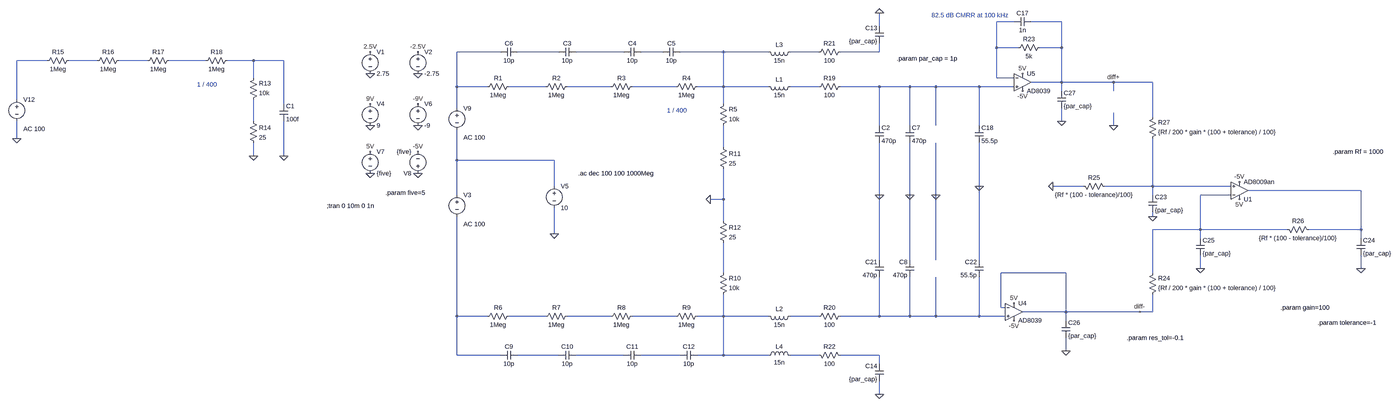
[diagram p0: schematic ac_analysis.asc, whole sheet]
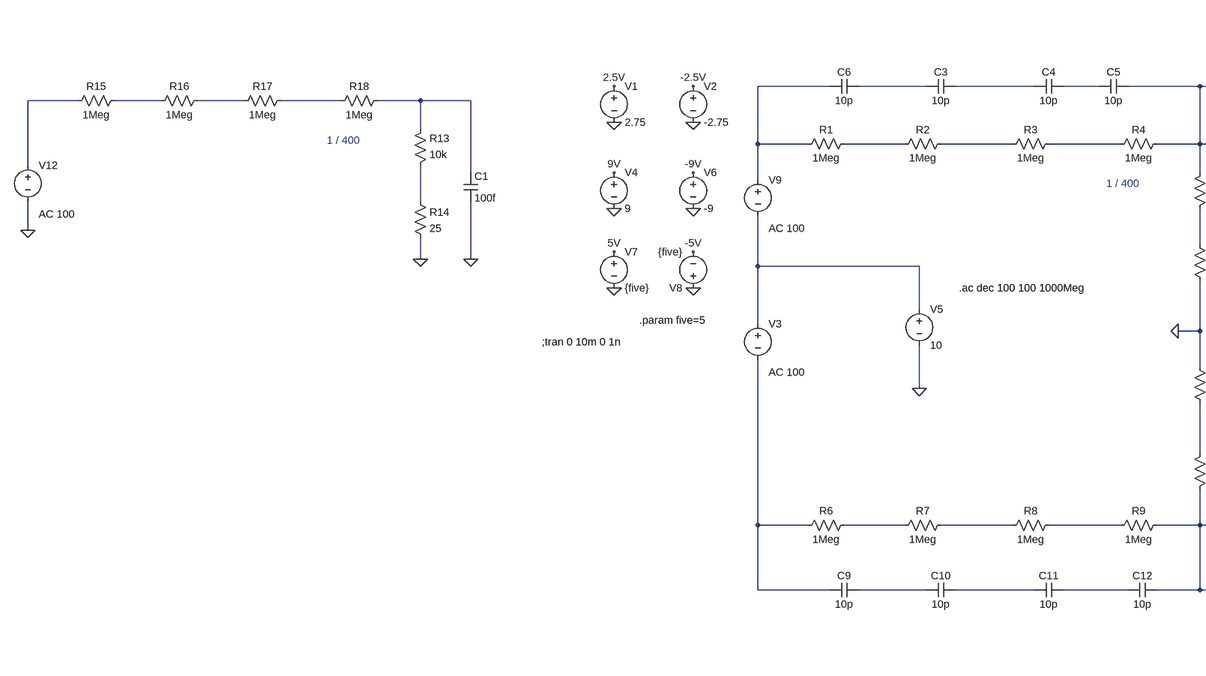
[diagram p1: schematic ac_analysis.asc, part, row 1 of 1, column 1 of 2]
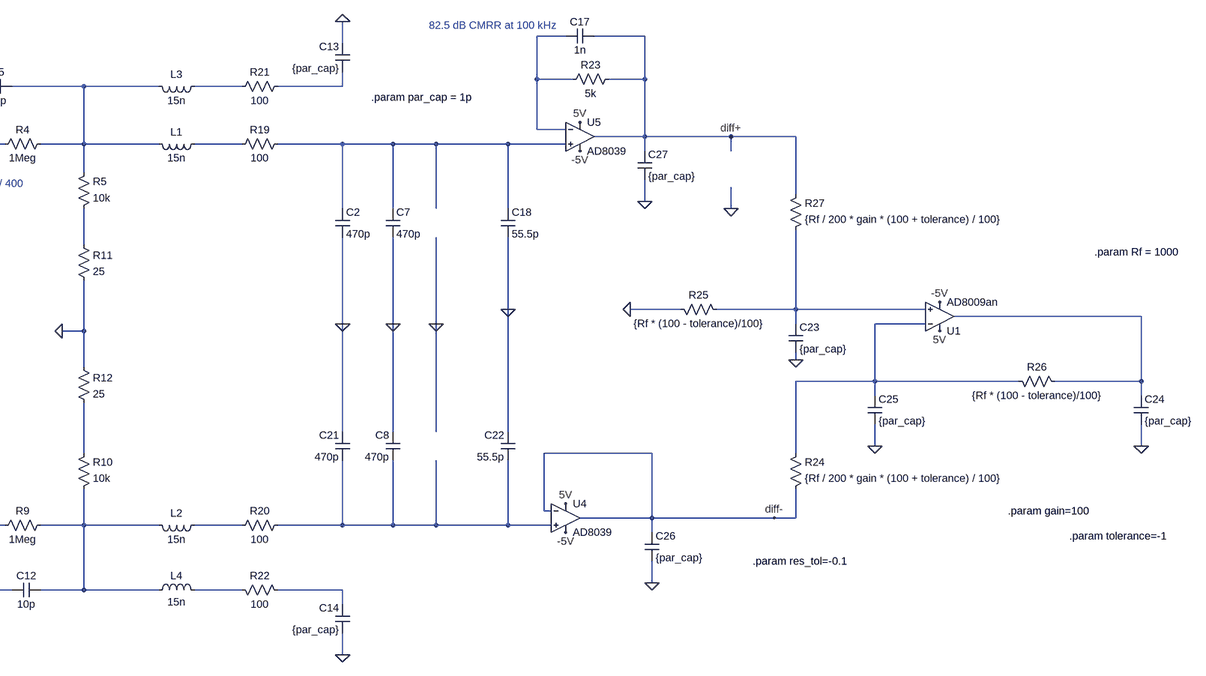
[diagram p2: schematic ac_analysis.asc, part, row 1 of 1, column 2 of 2]
ac_analysis.asc, the LTspice schematic file:
Version 4
SHEET 1 3908 1588
WIRE 2496 -368 2432 -368
WIRE 2672 -368 2560 -368
WIRE 2000 -352 2000 -400
WIRE 2432 -272 2432 -368
WIRE 2512 -272 2432 -272
WIRE 2672 -272 2672 -368
WIRE 2672 -272 2592 -272
WIRE 400 -256 240 -256
WIRE 640 -256 464 -256
WIRE 880 -256 704 -256
WIRE 1024 -256 944 -256
WIRE 1248 -256 1088 -256
WIRE 1456 -256 1248 -256
WIRE 1776 -256 1536 -256
WIRE 2000 -256 2000 -288
WIRE 2000 -256 1856 -256
WIRE -1520 -224 -1632 -224
WIRE -1280 -224 -1440 -224
WIRE -1040 -224 -1200 -224
WIRE -800 -224 -960 -224
WIRE -624 -224 -720 -224
WIRE -512 -224 -624 -224
WIRE -624 -160 -624 -224
WIRE 2432 -160 2432 -272
WIRE 2496 -160 2432 -160
WIRE 2672 -144 2672 -272
WIRE 2672 -144 2560 -144
WIRE 2864 -144 2672 -144
WIRE 3008 -144 2864 -144
WIRE 240 -128 240 -256
WIRE 352 -128 240 -128
WIRE 592 -128 432 -128
WIRE 832 -128 672 -128
WIRE 1072 -128 912 -128
WIRE 1248 -128 1248 -256
WIRE 1248 -128 1152 -128
WIRE 1456 -128 1248 -128
WIRE 1776 -128 1536 -128
WIRE 2000 -128 1856 -128
WIRE 2112 -128 2000 -128
WIRE 2208 -128 2112 -128
WIRE 2368 -128 2208 -128
WIRE 2496 -128 2368 -128
WIRE 2672 -112 2672 -144
WIRE 2864 -112 2864 -144
WIRE -1632 -80 -1632 -224
WIRE -512 -64 -512 -224
WIRE 1248 -64 1248 -128
WIRE 240 -48 240 -128
WIRE 3008 -16 3008 -144
WIRE -624 0 -624 -80
WIRE 2672 0 2672 -48
WIRE 2000 16 2000 -128
WIRE 2112 16 2112 -128
WIRE 2208 16 2208 -128
WIRE 2368 16 2368 -128
WIRE 2864 16 2864 -32
WIRE -1632 64 -1632 0
WIRE 1248 96 1248 16
WIRE -624 128 -624 80
WIRE -512 128 -512 0
WIRE 240 144 240 32
WIRE 624 144 240 144
WIRE 624 240 624 144
WIRE 2368 240 2368 80
WIRE 2752 240 2640 240
WIRE 3008 240 3008 64
WIRE 3008 240 2832 240
WIRE 3296 240 3008 240
WIRE 3776 256 3360 256
WIRE 240 272 240 144
WIRE 2000 272 2000 80
WIRE 2112 272 2112 80
WIRE 2208 272 2208 80
WIRE 3008 272 3008 240
WIRE 3296 272 3184 272
WIRE 1248 288 1248 176
WIRE 1248 288 1200 288
WIRE 3008 352 3008 336
WIRE 1248 368 1248 288
WIRE 3184 400 3184 272
WIRE 3184 400 3008 400
WIRE 3504 400 3184 400
WIRE 3776 400 3776 256
WIRE 3776 400 3584 400
WIRE 624 416 624 320
WIRE 3184 432 3184 400
WIRE 3776 432 3776 400
WIRE 2000 512 2000 272
WIRE 2112 512 2112 272
WIRE 2208 512 2208 272
WIRE 2368 512 2368 240
WIRE 3184 544 3184 496
WIRE 3776 544 3776 496
WIRE 1248 560 1248 448
WIRE 2688 560 2448 560
WIRE 3008 560 3008 400
WIRE 2448 688 2448 560
WIRE 2464 688 2448 688
WIRE 2688 704 2688 560
WIRE 2688 704 2528 704
WIRE 2960 704 2688 704
WIRE 3008 704 3008 640
WIRE 3008 704 2960 704
WIRE 240 720 240 352
WIRE 352 720 240 720
WIRE 592 720 432 720
WIRE 832 720 672 720
WIRE 1072 720 912 720
WIRE 1248 720 1248 640
WIRE 1248 720 1152 720
WIRE 1456 720 1248 720
WIRE 1776 720 1536 720
WIRE 2000 720 2000 576
WIRE 2000 720 1856 720
WIRE 2112 720 2112 576
WIRE 2112 720 2000 720
WIRE 2208 720 2208 576
WIRE 2208 720 2112 720
WIRE 2368 720 2368 576
WIRE 2368 720 2208 720
WIRE 2464 720 2368 720
WIRE 2688 736 2688 704
WIRE 2688 848 2688 800
WIRE 240 864 240 720
WIRE 400 864 240 864
WIRE 640 864 464 864
WIRE 880 864 704 864
WIRE 1088 864 944 864
WIRE 1248 864 1248 720
WIRE 1248 864 1152 864
WIRE 1456 864 1248 864
WIRE 1776 864 1536 864
WIRE 2000 864 1856 864
WIRE 2000 896 2000 864
WIRE 2000 1008 2000 960
FLAG -80 -176 0
FLAG -80 -256 2.5V
FLAG 96 -176 0
FLAG 96 -256 -2.5V
FLAG 1200 288 0
FLAG 2208 272 0
FLAG 624 416 0
FLAG 2112 272 0
FLAG -80 16 0
FLAG -80 -64 9V
FLAG 96 16 0
FLAG 96 -64 -9V
FLAG -80 192 0
FLAG -80 112 5V
FLAG 96 192 0
FLAG 96 112 -5V
FLAG 2000 272 0
FLAG -624 128 0
FLAG -1632 64 0
FLAG -512 128 0
FLAG 2000 -400 0
FLAG 2000 1008 0
FLAG 2864 16 0
FLAG 2368 240 0
FLAG 2528 -176 5V
FLAG 2528 -112 -5V
FLAG 2640 240 0
FLAG 2496 672 5V
FLAG 2496 736 -5V
FLAG 3328 288 5V
FLAG 3328 224 -5V
FLAG 2864 -144 diff+
FLAG 2960 704 diff-
FLAG 3008 352 0
FLAG 3184 544 0
FLAG 3776 544 0
FLAG 2688 848 0
FLAG 2672 0 0
SYMBOL voltage -80 -272 R0
SYMATTR InstName V1
SYMATTR Value 2.75
SYMBOL voltage 96 -272 R0
SYMATTR InstName V2
SYMATTR Value -2.75
SYMBOL voltage 240 256 R0
WINDOW 123 24 124 Left 2
WINDOW 39 0 0 Left 0
SYMATTR Value2 AC 100
SYMATTR InstName V3
SYMATTR Value ""
SYMBOL res 1232 656 M180
WINDOW 0 36 76 Left 2
WINDOW 3 36 40 Left 2
SYMATTR InstName R10
SYMATTR Value 10k
SYMBOL cap 464 -272 R90
WINDOW 0 0 32 VBottom 2
WINDOW 3 32 32 VTop 2
SYMATTR InstName C6
SYMATTR Value 10p
SYMBOL cap 704 -272 R90
WINDOW 0 0 32 VBottom 2
WINDOW 3 32 32 VTop 2
SYMATTR InstName C3
SYMATTR Value 10p
SYMBOL cap 944 -272 R90
WINDOW 0 0 32 VBottom 2
WINDOW 3 32 32 VTop 2
SYMATTR InstName C4
SYMATTR Value 10p
SYMBOL cap 1088 -272 R90
WINDOW 0 0 32 VBottom 2
WINDOW 3 32 32 VTop 2
SYMATTR InstName C5
SYMATTR Value 10p
SYMBOL cap 464 848 R90
WINDOW 0 0 32 VBottom 2
WINDOW 3 32 32 VTop 2
SYMATTR InstName C9
SYMATTR Value 10p
SYMBOL cap 704 848 R90
WINDOW 0 0 32 VBottom 2
WINDOW 3 32 32 VTop 2
SYMATTR InstName C10
SYMATTR Value 10p
SYMBOL cap 944 848 R90
WINDOW 0 0 32 VBottom 2
WINDOW 3 32 32 VTop 2
SYMATTR InstName C11
SYMATTR Value 10p
SYMBOL cap 1152 848 R90
WINDOW 0 0 32 VBottom 2
WINDOW 3 32 32 VTop 2
SYMATTR InstName C12
SYMATTR Value 10p
SYMBOL res 1232 32 M180
WINDOW 0 36 76 Left 2
WINDOW 3 36 40 Left 2
SYMATTR InstName R5
SYMATTR Value 10k
SYMBOL voltage 624 224 R0
WINDOW 123 0 0 Left 0
WINDOW 39 0 0 Left 0
SYMATTR InstName V5
SYMATTR Value 10
SYMBOL cap 2096 16 R0
SYMATTR InstName C7
SYMATTR Value 470p
SYMBOL cap 2128 576 R180
WINDOW 0 24 56 Left 2
WINDOW 3 24 8 Left 2
SYMATTR InstName C8
SYMATTR Value 470p
SYMBOL voltage -80 -80 R0
SYMATTR InstName V4
SYMATTR Value 9
SYMBOL voltage 96 -80 R0
SYMATTR InstName V6
SYMATTR Value -9
SYMBOL voltage -80 96 R0
SYMATTR InstName V7
SYMATTR Value {five}
SYMBOL voltage 96 208 R180
WINDOW 123 0 0 Left 0
WINDOW 39 0 0 Left 0
SYMATTR InstName V8
SYMATTR Value {five}
SYMBOL res 1232 80 R0
SYMATTR InstName R11
SYMATTR Value 25
SYMBOL res 1232 352 R0
SYMATTR InstName R12
SYMATTR Value 25
SYMBOL cap 1984 16 R0
SYMATTR InstName C2
SYMATTR Value 470p
SYMBOL cap 2016 576 R180
WINDOW 0 24 56 Left 2
WINDOW 3 24 8 Left 2
SYMATTR InstName C21
SYMATTR Value 470p
SYMBOL voltage 240 -64 R0
WINDOW 123 24 124 Left 2
WINDOW 39 0 0 Left 0
SYMATTR Value2 AC 100
SYMATTR InstName V9
SYMATTR Value ""
SYMBOL ind 1552 -144 R90
WINDOW 0 5 56 VBottom 2
WINDOW 3 32 56 VTop 2
SYMATTR InstName L1
SYMATTR Value 15n
SYMBOL res 448 -144 R90
WINDOW 0 0 56 VBottom 2
WINDOW 3 32 56 VTop 2
SYMATTR InstName R1
SYMATTR Value 1Meg
SYMBOL res 688 -144 R90
WINDOW 0 0 56 VBottom 2
WINDOW 3 32 56 VTop 2
SYMATTR InstName R2
SYMATTR Value 1Meg
SYMBOL res 928 -144 R90
WINDOW 0 0 56 VBottom 2
WINDOW 3 32 56 VTop 2
SYMATTR InstName R3
SYMATTR Value 1Meg
SYMBOL res 1168 -144 R90
WINDOW 0 0 56 VBottom 2
WINDOW 3 32 56 VTop 2
SYMATTR InstName R4
SYMATTR Value 1Meg
SYMBOL res 448 704 R90
WINDOW 0 0 56 VBottom 2
WINDOW 3 32 56 VTop 2
SYMATTR InstName R6
SYMATTR Value 1Meg
SYMBOL res 688 704 R90
WINDOW 0 0 56 VBottom 2
WINDOW 3 32 56 VTop 2
SYMATTR InstName R7
SYMATTR Value 1Meg
SYMBOL res 928 704 R90
WINDOW 0 0 56 VBottom 2
WINDOW 3 32 56 VTop 2
SYMATTR InstName R8
SYMATTR Value 1Meg
SYMBOL res 1168 704 R90
WINDOW 0 0 56 VBottom 2
WINDOW 3 32 56 VTop 2
SYMATTR InstName R9
SYMATTR Value 1Meg
SYMBOL res -640 -64 M180
WINDOW 0 36 76 Left 2
WINDOW 3 36 40 Left 2
SYMATTR InstName R13
SYMATTR Value 10k
SYMBOL res -640 -16 R0
SYMATTR InstName R14
SYMATTR Value 25
SYMBOL voltage -1632 -96 R0
WINDOW 123 24 124 Left 2
WINDOW 39 0 0 Left 0
SYMATTR Value2 AC 100
SYMATTR InstName V12
SYMATTR Value ""
SYMBOL res -1424 -240 R90
WINDOW 0 0 56 VBottom 2
WINDOW 3 32 56 VTop 2
SYMATTR InstName R15
SYMATTR Value 1Meg
SYMBOL res -1184 -240 R90
WINDOW 0 0 56 VBottom 2
WINDOW 3 32 56 VTop 2
SYMATTR InstName R16
SYMATTR Value 1Meg
SYMBOL res -944 -240 R90
WINDOW 0 0 56 VBottom 2
WINDOW 3 32 56 VTop 2
SYMATTR InstName R17
SYMATTR Value 1Meg
SYMBOL res -704 -240 R90
WINDOW 0 0 56 VBottom 2
WINDOW 3 32 56 VTop 2
SYMATTR InstName R18
SYMATTR Value 1Meg
SYMBOL cap -528 -64 R0
SYMATTR InstName C1
SYMATTR Value 100f
SYMBOL ind 1552 704 R90
WINDOW 0 5 56 VBottom 2
WINDOW 3 32 56 VTop 2
SYMATTR InstName L2
SYMATTR Value 15n
SYMBOL res 1872 -144 R90
WINDOW 0 0 56 VBottom 2
WINDOW 3 32 56 VTop 2
SYMATTR InstName R19
SYMATTR Value 100
SYMBOL res 1872 704 R90
WINDOW 0 0 56 VBottom 2
WINDOW 3 32 56 VTop 2
SYMATTR InstName R20
SYMATTR Value 100
SYMBOL ind 1552 -272 R90
WINDOW 0 5 56 VBottom 2
WINDOW 3 32 56 VTop 2
SYMATTR InstName L3
SYMATTR Value 15n
SYMBOL res 1872 -272 R90
WINDOW 0 0 56 VBottom 2
WINDOW 3 32 56 VTop 2
SYMATTR InstName R21
SYMATTR Value 100
SYMBOL cap 2016 -288 R180
WINDOW 0 24 56 Left 2
WINDOW 3 24 8 Left 2
SYMATTR InstName C13
SYMATTR Value {par_cap}
SYMBOL ind 1552 880 M270
WINDOW 0 32 56 VTop 2
WINDOW 3 5 56 VBottom 2
SYMATTR InstName L4
SYMATTR Value 15n
SYMBOL res 1872 880 M270
WINDOW 0 32 56 VTop 2
WINDOW 3 0 56 VBottom 2
SYMATTR InstName R22
SYMATTR Value 100
SYMBOL cap 2016 896 M0
SYMATTR InstName C14
SYMATTR Value {par_cap}
SYMBOL res 2608 -288 R90
WINDOW 0 0 56 VBottom 2
WINDOW 3 32 56 VTop 2
SYMATTR InstName R23
SYMATTR Value 5k
SYMBOL cap 2560 -384 R90
WINDOW 0 0 32 VBottom 2
WINDOW 3 32 32 VTop 2
SYMATTR InstName C17
SYMATTR Value 1n
SYMBOL cap 2352 16 R0
SYMATTR InstName C18
SYMATTR Value 55.5p
SYMBOL cap 2384 576 R180
WINDOW 0 24 56 Left 2
WINDOW 3 24 8 Left 2
SYMATTR InstName C22
SYMATTR Value 55.5p
SYMBOL res 2992 656 M180
WINDOW 0 36 76 Left 2
WINDOW 3 36 40 Left 2
SYMATTR InstName R24
SYMATTR Value {Rf / 200 * gain * (100 + tolerance) / 100}
SYMBOL res 2736 224 M90
WINDOW 0 0 56 VBottom 2
WINDOW 3 32 56 VTop 2
SYMATTR InstName R25
SYMATTR Value {Rf * (100 - tolerance)/100}
SYMBOL ZZZ\\OpAmp\\AD8009an 3328 256 M180
SYMATTR InstName U1
SYMBOL cap 2992 272 R0
SYMATTR InstName C23
SYMATTR Value {par_cap}
SYMBOL res 3488 384 M90
WINDOW 0 0 56 VBottom 2
WINDOW 3 32 56 VTop 2
SYMATTR InstName R26
SYMATTR Value {Rf * (100 - tolerance)/100}
SYMBOL res 2992 80 M180
WINDOW 0 36 76 Left 2
WINDOW 3 36 40 Left 2
SYMATTR InstName R27
SYMATTR Value {Rf / 200 * gain * (100 + tolerance) / 100}
SYMBOL cap 3760 432 R0
SYMATTR InstName C24
SYMATTR Value {par_cap}
SYMBOL cap 3168 432 R0
SYMATTR InstName C25
SYMATTR Value {par_cap}
SYMBOL cap 2672 736 R0
SYMATTR InstName C26
SYMATTR Value {par_cap}
SYMBOL cap 2656 -112 R0
SYMATTR InstName C27
SYMATTR Value {par_cap}
SYMBOL OpAmps\\AD8039 2496 640 R0
SYMATTR InstName U4
SYMBOL OpAmps\\AD8039 2528 -208 R0
SYMATTR InstName U5
TEXT -240 312 Left 2 !;tran 0 10m 0 1n
TEXT 1040 -40 Left 2 ;1 / 400
TEXT -24 264 Left 2 !.param five=5
TEXT 2192 -392 Left 2 ;82.5 dB CMRR at 100 kHz
TEXT 712 192 Left 2 !.ac dec 100 100 1000Meg
TEXT 2064 -232 Left 2 !.param par_cap = 1p
TEXT -832 -136 Left 2 ;1 / 400
TEXT 3616 744 Left 2 !.param tolerance=-1
TEXT 2912 800 Left 2 !.param res_tol=-0.1
TEXT 3480 688 Left 2 !.param gain=100
TEXT 3672 112 Left 2 !.param Rf = 1000

The netlist it stands for:
* ac_analysis.asc
V1 2.5V 0 2.75
V2 -2.5V 0 -2.75
V3 N021 N026 AC 100
R10 N030 N025 10k
C6 N003 N002 10p
C3 N004 N003 10p
C4 N005 N004 10p
C5 N006 N005 10p
C9 N033 N026 10p
C10 N034 N033 10p
C11 N035 N034 10p
C12 N030 N035 10p
R5 N020 N006 10k
V5 N021 0 10
C7 N018 0 470p
C8 N032 0 470p
V4 9V 0 9
V6 -9V 0 -9
V7 5V 0 {five}
V8 0 -5V {five}
R11 N020 0 25
R12 0 N025 25
C2 N018 0 470p
C21 N032 0 470p
V9 N002 N021 AC 100
L1 N017 N006 15n
R1 N014 N002 1Meg
R2 N015 N014 1Meg
R3 N016 N015 1Meg
R4 N006 N016 1Meg
R6 N027 N026 1Meg
R7 N028 N027 1Meg
R8 N029 N028 1Meg
R9 N030 N029 1Meg
R13 N019 N013 10k
R14 N019 0 25
V12 N009 0 AC 100
R15 N010 N009 1Meg
R16 N011 N010 1Meg
R17 N012 N011 1Meg
R18 N013 N012 1Meg
C1 N013 0 100f
L2 N031 N030 15n
R19 N018 N017 100
R20 N032 N031 100
L3 N007 N006 15n
R21 N008 N007 100
C13 N008 0 {par_cap}
L4 N036 N030 15n
R22 N037 N036 100
C14 N037 0 {par_cap}
R23 diff+ N001 5k
C17 diff+ N001 1n
C18 N018 0 55.5p
C22 N032 0 55.5p
R24 diff- N024 {Rf / 200 * gain * (100 + tolerance) / 100}
R25 0 N022 {Rf * (100 - tolerance)/100}
* U1: AD8009an (symbol ZZZ\OpAmp\AD8009an not available, pins judged from their places): In+=N022 In-=N024 V+=5V V-=-5V OUT=N023
C23 N022 0 {par_cap}
R26 N024 N023 {Rf * (100 - tolerance)/100}
R27 N022 diff+ {Rf / 200 * gain * (100 + tolerance) / 100}
C24 N023 0 {par_cap}
C25 N024 0 {par_cap}
C26 diff- 0 {par_cap}
C27 diff+ 0 {par_cap}
XU4 N032 diff- 5V -5V diff- AD8039  ; pins In+ In- V+ V- OUT
XU5 N018 N001 5V -5V diff+ AD8039  ; pins In+ In- V+ V- OUT
;tran 0 10m 0 1n
* 1 / 400
.param five=5
* 82.5 dB CMRR at 100 kHz
.ac dec 100 100 1000Meg
.param par_cap = 1p
* 1 / 400
.param tolerance=-1
.param res_tol=-0.1
.param gain=100
.param Rf = 1000
.backanno
.end